# Altium schematic sheet Top.SchDoc
size A4
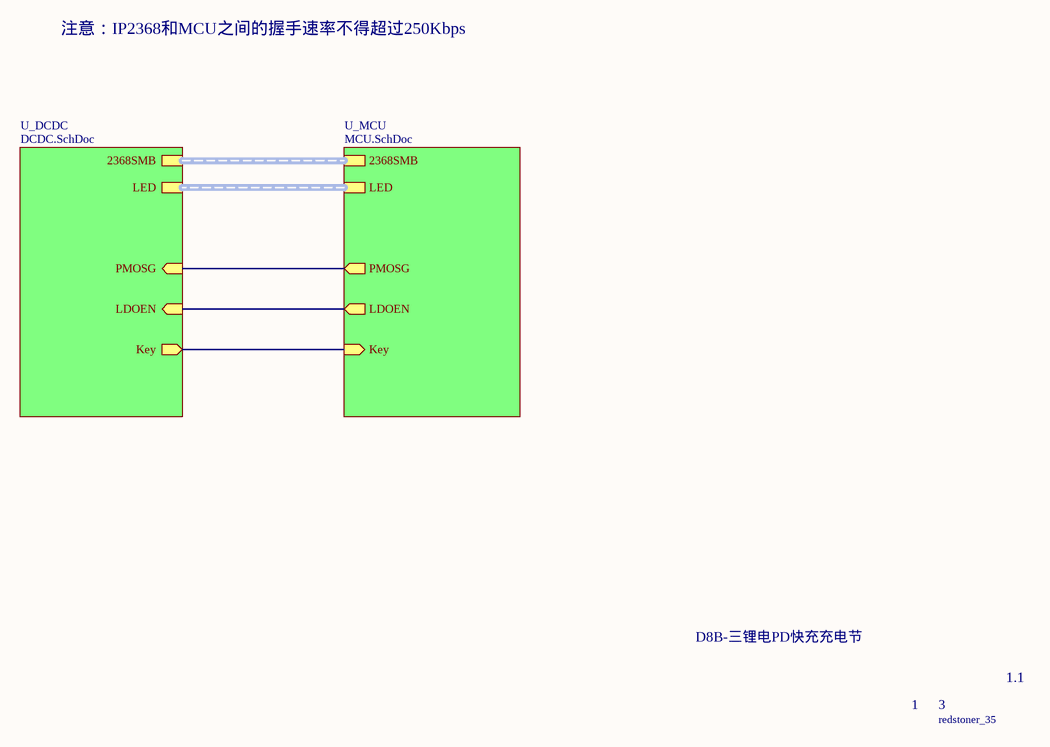
[diagram p0: Top.SchDoc]

## Sub-sheets
U_DCDC = DCDC.SchDoc: 2368SMB (harness 2368_SMB), PMOSG (in), LDOEN (in), LED (harness LED), Key (out)
U_MCU = MCU.SchDoc: PMOSG (out), 2368SMB (harness 2368_SMB), LDOEN (out), LED (harness LED), Key (in)

## Nets
(unnamed): sheet U_DCDC/PMOSG, sheet U_MCU/PMOSG
(unnamed): sheet U_DCDC/LDOEN, sheet U_MCU/LDOEN
(unnamed): sheet U_DCDC/Key, sheet U_MCU/Key

## Buses and harness runs
harness sheet U_DCDC/2368SMB = sheet U_MCU/2368SMB
harness sheet U_DCDC/LED = sheet U_MCU/LED

## Notes on the sheet
- 注意：IP2368和MCU之间的握手速率不得超过250Kbps
- D8B-三锂电PD快充充电节
- 1
- 3
- 1.1
- redstoner_35